# Altium schematic sheet Switch_Output.SchDoc
size 127 x 101 mm; SheetNumber: 3; SheetTotal: 4
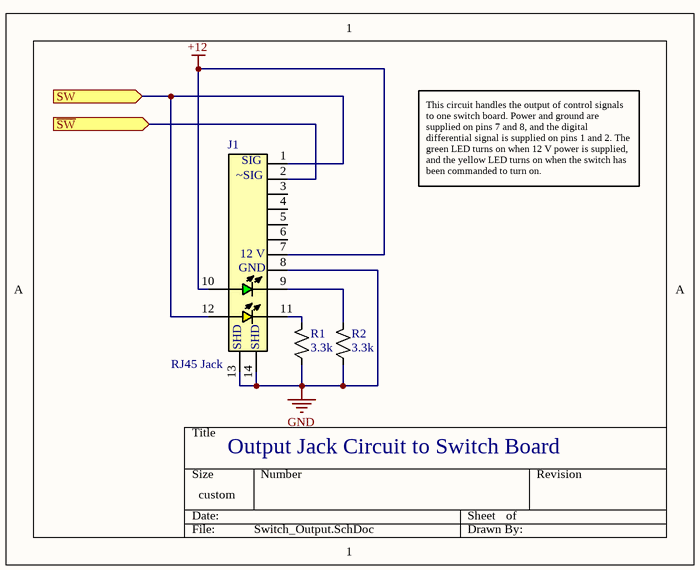
[diagram p0: Switch_Output.SchDoc]

## Parts
J1  RJ45 Jack  [RJ45_JACK]
R1  3.3k  [0603_RES]
R2  3.3k  [0603_RES]

## Ports
SW (in, see Load_Bank_Master[4C]), ~{SW} (in, see Load_Bank_Master[4C])

## Nets
+12: J1.7(12_V) J1.10
GND: J1.8(GND) J1.13(SHD1) J1.14(SHD2) R1.1 R2.1
~{SW}: J1.2(Sig2) ; port ~{SW}
SW: J1.1(Sig1) J1.12 ; port SW
NetJ1_9: J1.9 R2.2
NetJ1_11: J1.11 R1.2

Not connected (* = marked no-connect by the designer): J1 3(NC) 4(NC) 5(NC) 6(NC)

## Notes on the sheet
- This circuit handles the output of control signals to one switch board. Power and ground are supplied on pins 7 and 8, and the digital differential signal is supplied on pins 1 and 2. The green LED turns on when 12 V power is supplied, and the yellow LED turns on when the switch has been commanded to turn on.
- Output Jack Circuit to Switch Board
- (in symbol J_RJ45_Jack) SIG; ~SIG; SHD

## Library data of the parts
J1 = J_RJ45_Jack: Jack RJ-45 8-pin
R1 R2 = R_3300Ohm_0603_1%: Resistor 3.3 kOhm 0603 1%